# EAGLE design LS013B7DH03_TFT_Module (EAGLE 6.4)
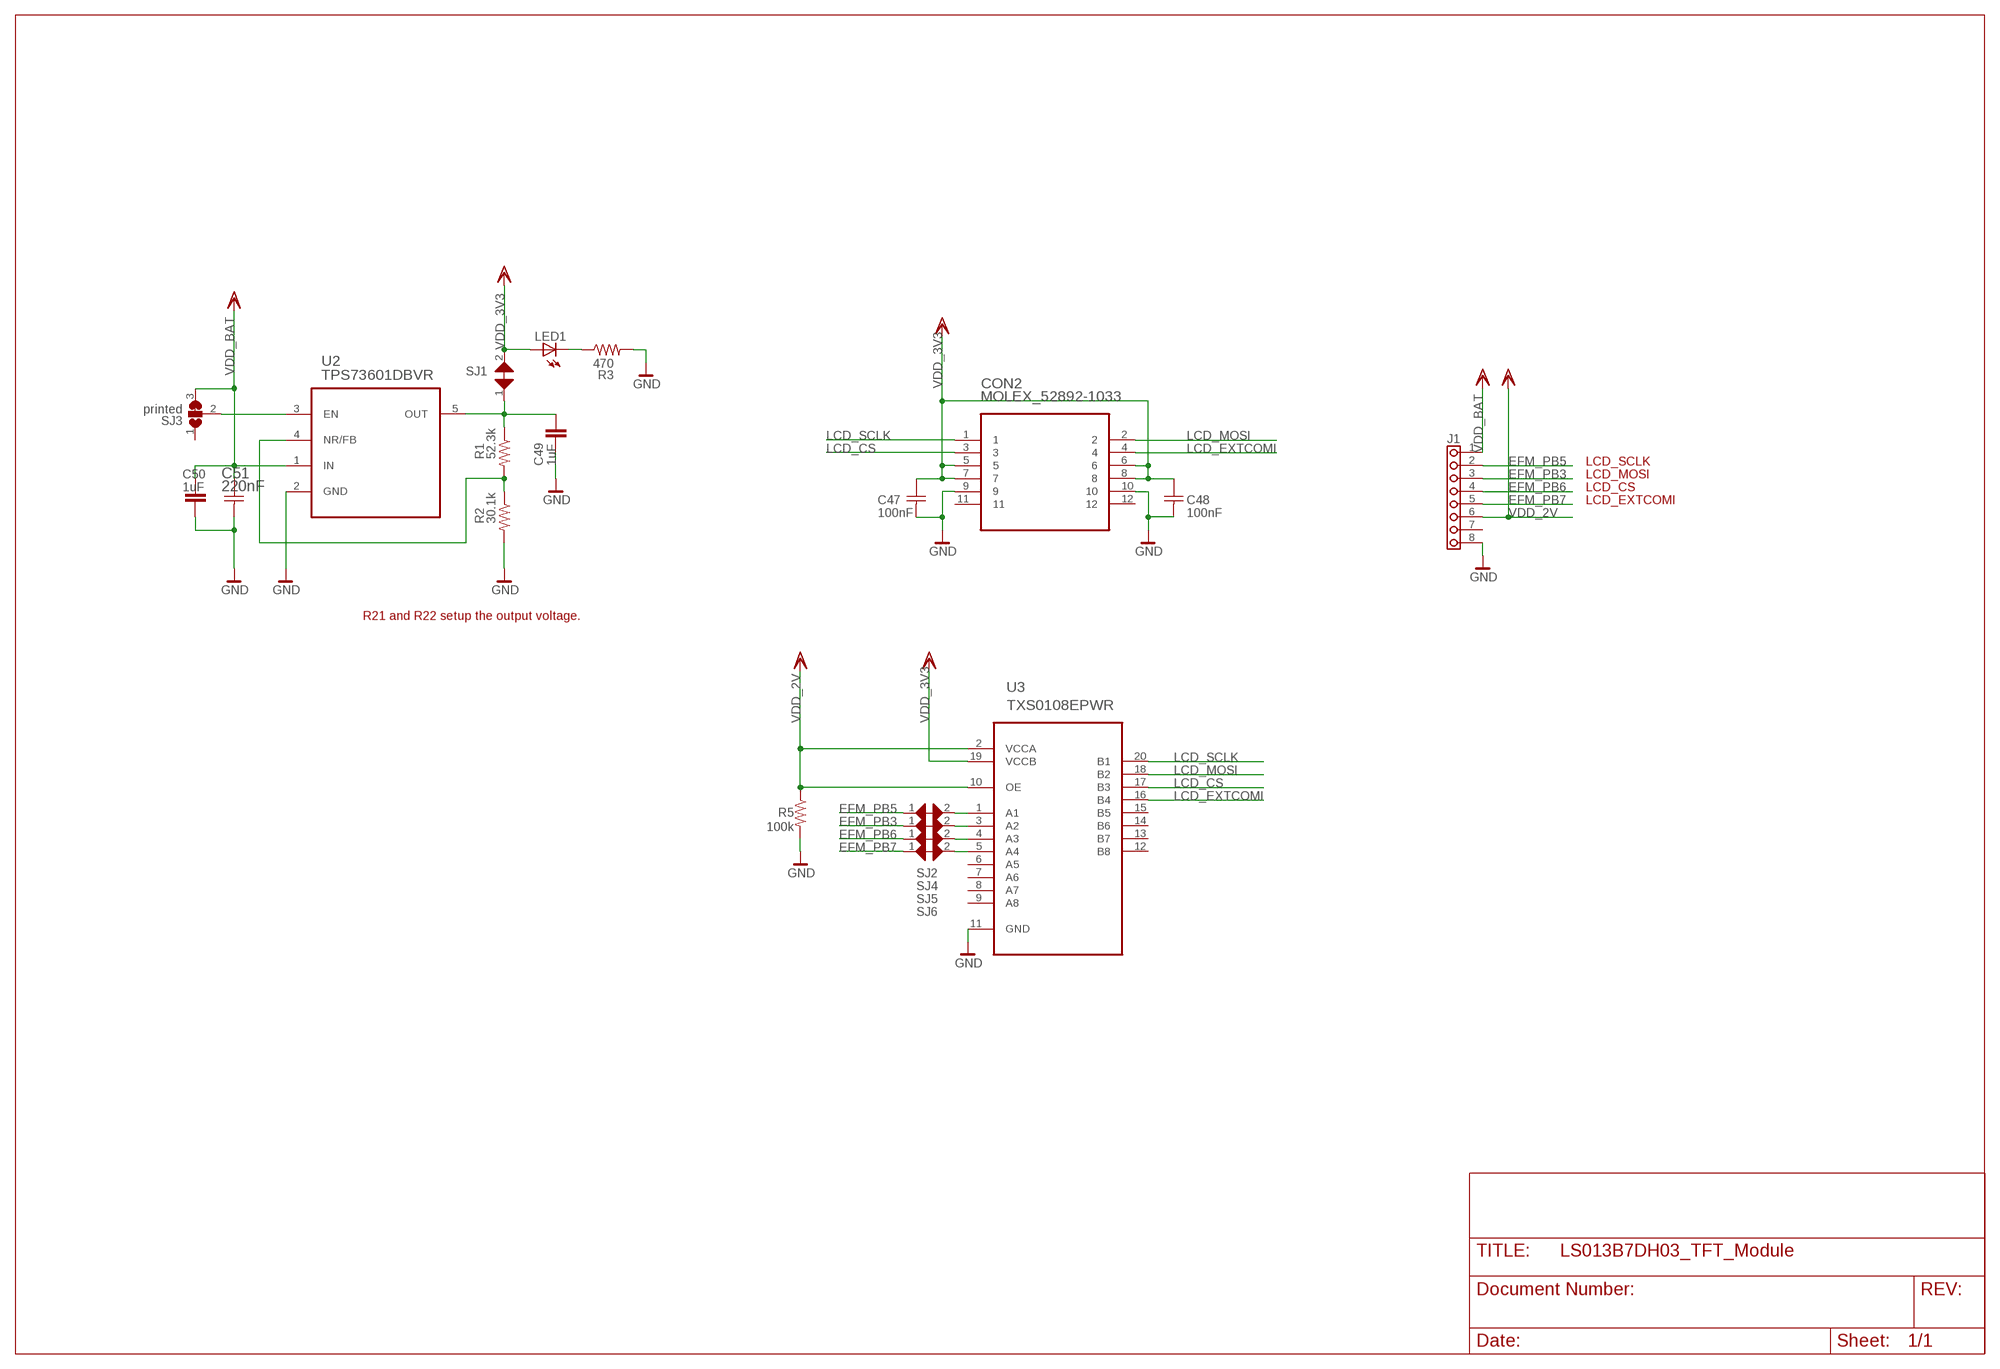
[diagram p0: schematic, sheet 1]

## Parts
C47  100nF  CAP_GRM15  [CAPC1005X60N]
C48  100nF  CAP_GRM15  [CAPC1005X60N]
C49  1uF  CAP-SMD0603  [0603]
C50  1uF  CAP-SMD0603  [0603]
C51  220nF  CAP_GRM15  [CAPC1005X60N]
CON2  MOLEX_52892-1033  MOLEX_52892-1033_FPC  [MOLEX_52892-1095]
J1  PIN8S  [PIN8S]
LED1  LED0603  [LED-0603]
R1  52.3k  R-US_R0402  [R0402]
R2  30.1k  R-US_R0402  [R0402]
R3  470  R-US_R0402  [R0402]
R5  100k  R-US_R0402  [R0402]
SJ1  printed  JUMPER_SMD_MICRO_SHORT  [JUMPER_SMD_MICRO_SHORT]
SJ2  printed  JUMPER_SMD_MICRO_SHORT  [JUMPER_SMD_MICRO_SHORT]
SJ3  printed  JUMPER_SMD_3A  [JUMPER_SMD_SJ2A]
SJ4  printed  JUMPER_SMD_MICRO_SHORT  [JUMPER_SMD_MICRO_SHORT]
SJ5  printed  JUMPER_SMD_MICRO_SHORT  [JUMPER_SMD_MICRO_SHORT]
SJ6  printed  JUMPER_SMD_MICRO_SHORT  [JUMPER_SMD_MICRO_SHORT]
U2  TPS73601DBVR  [SOT95P280X145-5N]
U3  TXS0108EPWR  TXB0108PWR  [SOP65P640X120-20N]

## Nets
EFM_PB3: J1.3 SJ4.1
EFM_PB5: J1.2 SJ2.1
EFM_PB6: J1.4 SJ5.1
EFM_PB7: J1.5 SJ6.1
GND: C47.2(C2) C48.2(C2) C49.1 C50.1 C51.2(C2) CON2.9 CON2.10 J1.8 R2.2 R3.2 R5.2 U2.2(GND) U3.11(GND)
LCD_CS: CON2.3 U3.17(B3)
LCD_EXTCOMI: CON2.4 U3.16(B4)
LCD_MOSI: CON2.2 U3.18(B2)
LCD_SCLK: CON2.1 U3.20(B1)
N$1: LED1.C R3.1
N$2: SJ2.2 U3.1(A1)
N$3: SJ4.2 U3.3(A2)
N$4: SJ5.2 U3.4(A3)
N$5: SJ6.2 U3.5(A4)
N$6: C49.2 R1.1 SJ1.1 U2.5(OUT)
N$12: R1.2 R2.1 U2.4(NR/FB)
N$16: SJ3.2 U2.3(EN)
VDD_2V: J1.6 R5.1 U3.2(VCCA) U3.10(OE)
VDD_3V3: C47.1(C1) C48.1(C1) CON2.5 CON2.6 CON2.7 CON2.8 LED1.A SJ1.2 U3.19(VCCB)
VDD_BAT: C50.2 C51.1(C1) J1.1 SJ3.3 U2.1(IN)
Unconnected: CON2.11 CON2.12 J1.7 SJ3.1 U3.6(A5) U3.7(A6) U3.8(A7) U3.9(A8) U3.12(B8) U3.13(B7) U3.14(B6) U3.15(B5)

## Notes on the sheet
- LCD_SCLK
- LCD_MOSI
- LCD_CS
- LCD_EXTCOMI
- R21 and R22 setup the output voltage.

## Library data of the parts
C47 C48 C51 = dzo:CAP_GRM15: Murata GRM15 series 0402 size capacitor; MURATA: GRM15 series
C49 C50 = lve_modositott:CAP-SMD
CON2 = dzo:MOLEX_52892-1033_FPC: MOLEX - 52892-1033 - SOCKET, FFC/FPC, ZIF, 0.50MM, 10P; DISTRI: Farnell; DISTRINR: 2361354; PARTNR: 52892-1033
J1 = lve_modositott:PIN8S
LED1 = dzo:LED: LEDs Standard schematic elements and footprints for 5mm, 3mm, 1206, and 0603 sized LEDs. 5mm - Spark Fun Electronics SKU : COM-00529 (and others)
R1-R3 R5 = resistor:R-US_: RESISTOR, American symbol
SJ1 SJ2 SJ4-SJ6 = dzo:JUMPER_SMD_MICRO_SHORT
SJ3 = lve_modositott:JUMPER_SMD_3A
U2 = dzo:TPS73601DBVR: Cap-Free, NMOS, 400mA Low-Dropout Regulator with Reverse Current Protection; ALTDISTRI_NEWARK: 87H2971; DISTRI: Farnell; DISTRINR: 1576489; PACKAGE: SOT-23-5; PARTNR: TPS73601DBVR; VENDOR: Texas Instruments
U3 = dzo:TXB0108PWR: 8-BIT BIDIRECTIONAL VOLTAGE-LEVEL TRANSLATOR; PACKAGE: TSSOP-20; SUPPLIER: Texas Instruments

## Board
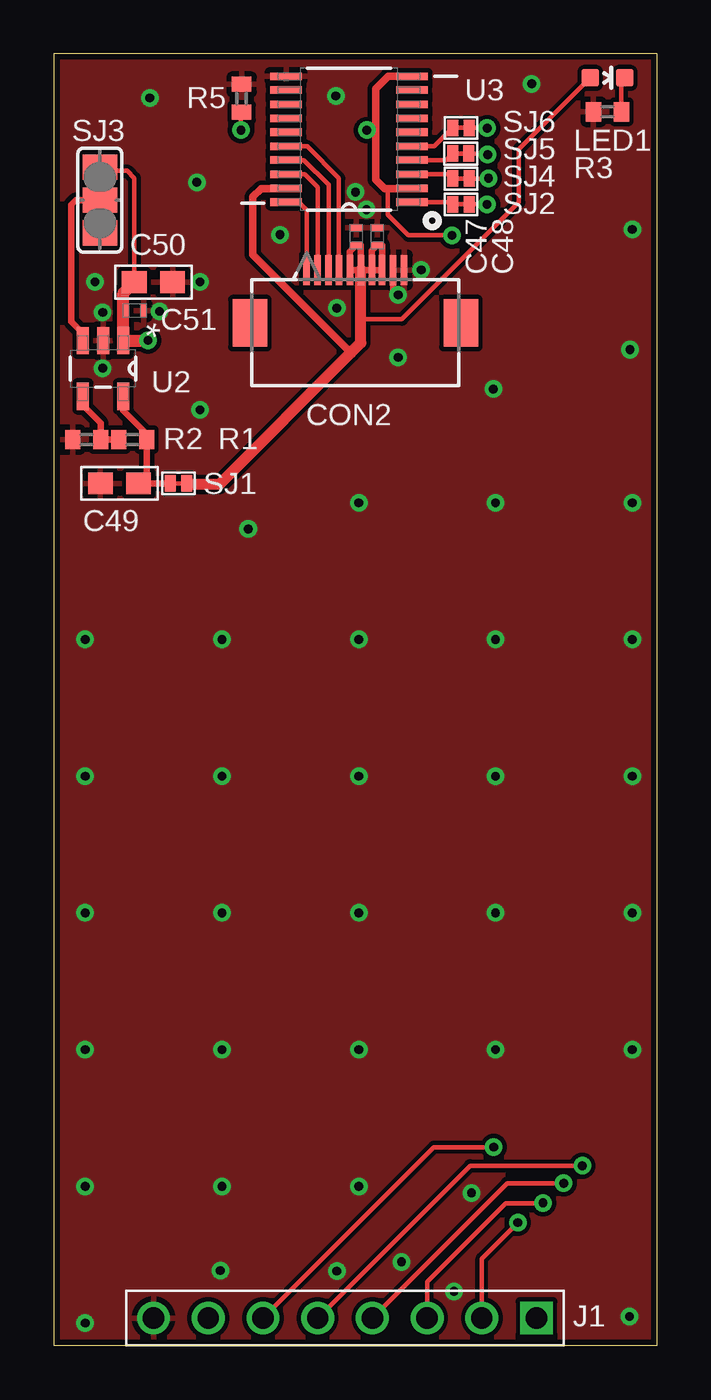
[diagram p1: board, top side]
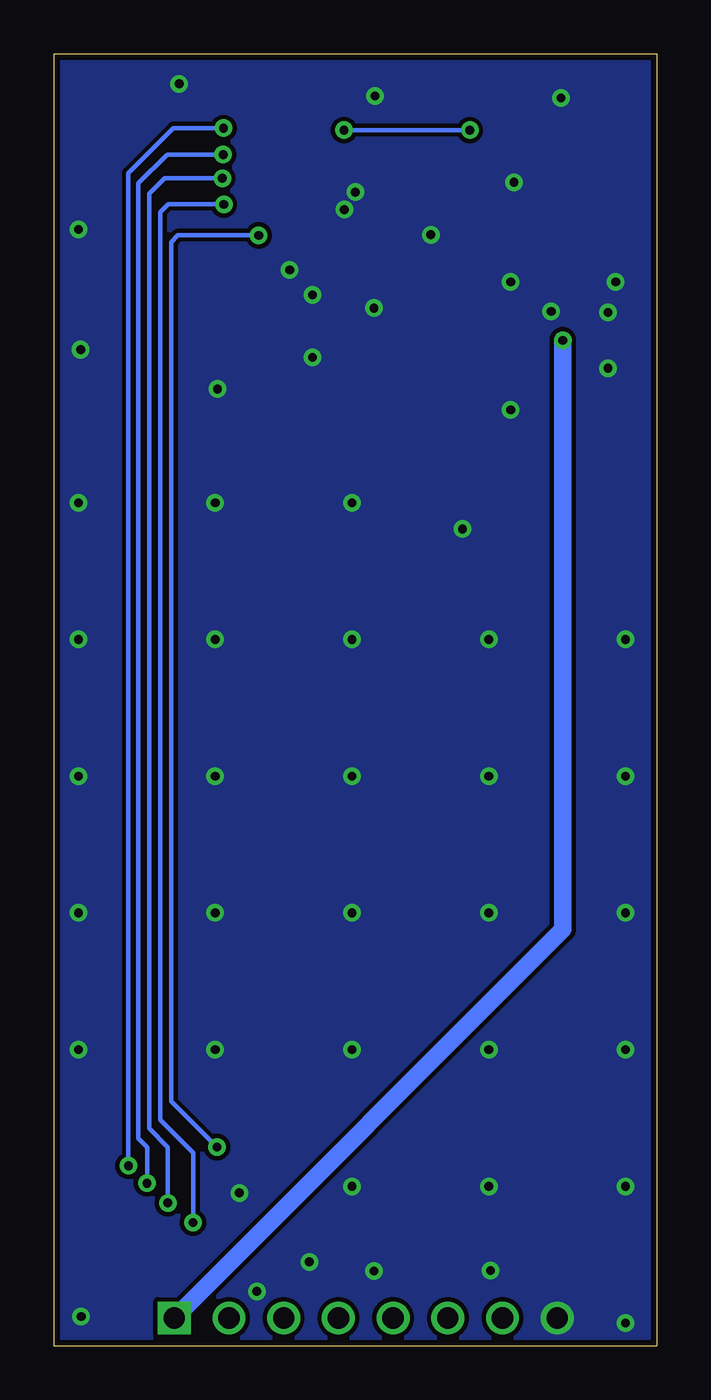
[diagram p2: board, bottom side, seen from below]

Size 28 x 60 mm. Coordinates in mm from the lower left corner, seen from the top.
Outline: 0,60 0,0 28,0 28,60 0,60
Copper layers (1*16): Top 0.0356mm / dielectric 1.5mm / Bottom 0.0356mm
Design rules "default_INTEGRATION *": minimum track width 6mil, minimum drill 16mil, track to track 8mil, track to pad 6mil, pad to pad 6mil, via to via 8mil, smd to smd 0mil, copper to edge 10mil, drill to drill 8mil, minimum pad ring 7mil, minimum via ring 8mil, stop-mask expansion 4mil, vias tented up to drill 24mil, thermal gap 10mil

### Footprints (pad centres in the part's own frame; a part is rotated, then mirrored left to right if it is on the bottom)
CAPC1005X60N = smd 0.305 x 0.61: 1 -0.406,0; 2 0.406,0
0603 = smd 1.143 x 1.016: 1 -0.889,0; 2 0.889,0
MOLEX_52892-1095 = smd 0.305 x 1.397: 1 2.261,2.896; 2 1.753,2.896; 3 1.245,2.896; 4 0.762,2.896; 5 0.254,2.896; 6 -0.254,2.896; 7 -0.762,2.896; 8 -1.245,2.896; 9 -1.753,2.896; 10 -2.261,2.896 | smd 1.6 x 2.21: 11 -4.902,5.359; 12 4.902,5.359
PIN8S = drill 0.991 pad 1.524 square: 1 0,0 | drill 0.991 pad 1.524: 2 2.54,0; 3 5.08,0; 4 7.62,0; 5 10.16,0; 6 12.7,0; 7 15.24,0; 8 17.78,0
LED-0603 = smd 0.8 x 0.8: A 0,-0.8; C 0,0.8
R0402 = smd 0.7 x 0.9: 1 -0.65,0; 2 0.65,0
JUMPER_SMD_MICRO_SHORT = smd 0.508 x 0.762: 1 -0.381,0; 2 0.381,0
JUMPER_SMD_SJ2A = smd 1.168 x 1.6: 1 -1.524,0; 2 0,0; 3 1.524,0
SOT95P280X145-5N = smd 1.27 x 0.559: 1 -1.295,0.94; 2 -1.295,0; 3 -1.295,-0.94; 4 1.295,-0.94; 5 1.295,0.94
SOP65P640X120-20N = smd 1.473 x 0.356: 1 -2.921,2.921; 2 -2.921,2.286; 3 -2.921,1.626; 4 -2.921,0.965; 5 -2.921,0.33; 6 -2.921,-0.33; 7 -2.921,-0.965; 8 -2.921,-1.626; 9 -2.921,-2.286; 10 -2.921,-2.921; 11 2.921,-2.921; 12 2.921,-2.286; 13 2.921,-1.626; 14 2.921,-0.965; 15 2.921,-0.33; 16 2.921,0.33; 17 2.921,0.965; 18 2.921,1.626; 19 2.921,2.286; 20 2.921,2.921

### Placement (x,y rotation side)
C47  14.05,51.52 90 top
C48  15.02,51.52 90 top
C49  3.05,40.05 0 top
C50  4.62,49.4 180 top
C51  3.76,48.08 0 top
CON2  14,52.85 180 top
J1  22.41,1.28 180 top
LED1  25.7,58.88 270 top
R1  3.66,42.08 180 top
R2  1.52,42.08 180 top
R3  25.7,57.31 180 top
R5  8.72,57.93 90 top
SJ1  5.79,40.05 180 top
SJ2  18.9,53.01 180 top
SJ3  2.13,53.21 90 top
SJ4  18.9,54.21 180 top
SJ5  18.89,55.37 0 top
SJ6  18.9,56.56 180 top
U2  2.29,45.38 270 top
U3  13.7,56.03 180 top

### Tracks (layer width: path | path; a pad name or v marks a point on that pad's centre or on a via)
EFM_PB3  (via drill 0.41, 0.41 pad 0.25)
  Top 0.203: v20.18,54.22 20.17,54.21 SJ4.1 | J1.3 17.33,2.96 20.98,6.61 22.69,6.61 v22.71,6.63
  Bottom 0.203: v22.71,6.63 22.71,9.22 23.57,10.08 23.57,53.5 22.85,54.22 v20.18,54.22
EFM_PB5  (via drill 0.41 pad 0.25)
  Top 0.203: v20.11,53.01 SJ2.1 | J1.2 19.87,4.04 v21.54,5.71
  Bottom 0.203: v20.11,53.01 22.69,53.01 23.06,52.64 23.06,10.49 21.54,8.97 v21.54,5.71
EFM_PB6  (via drill 0.41, 0.41 pad 0.25)
  Top 0.203: v20.14,55.32 20.09,55.37 19.27,55.37 | J1.4 21.05,7.54 v23.67,7.54
  Bottom 0.203: v20.14,55.32 22.74,55.32 24.08,53.98 24.08,9.63 23.67,9.22 v23.67,7.54
EFM_PB7  (via drill 0.41, 0.41 pad 0.25)
  Top 0.203: v20.12,56.55 20.11,56.56 SJ6.1 | J1.5 19.32,8.36 v24.54,8.36
  Bottom 0.203: v20.12,56.55 22.45,56.55 24.54,54.46 v24.54,8.36
GND  (via drill 0.41)
  Top 0.305: CON2.9 15.75,49.03 v15.98,48.8
  other vias: 1.46,26.45 26.86,26.45 26.86,32.8 26.86,39.15 1.46,32.8 26.76,46.26 26.86,51.85 7.81,26.45 14.16,26.45 20.51,26.45 20.51,32.8 14.16,32.8 7.81,32.8 14.16,39.15 20.51,39.15 14.51,52.76 14,53.58 13.09,58.05 17.05,49.97 13.14,48.19 10.5,51.6 4.45,57.95 6.64,54.03 6.79,43.47 6.79,49.41 4.91,48.04 1.46,20.1 7.81,20.1 14.16,20.1 20.51,20.1 26.86,20.1 26.86,13.75 20.51,13.75 14.16,13.75 7.81,13.75 1.46,13.75 1.46,7.4 7.81,7.4 14.16,7.4 1.46,1.05 7.73,3.49 13.14,3.46 26.73,1.35 22.18,58.61 20.41,44.43 15.99,45.91 1.91,49.41 2.27,45.4 2.27,47.99 9.03,37.93 19.39,7.09 16.14,3.89 18.58,2.52
  pour Bottom (rank 2, no thermals): 28,0 0,0 0,59.98 28.03,59.98
  pour Top (rank 2): 28,0 0,0 0,59.98 28.03,59.98
LCD_CS
  Top 0.203: CON2.3 12.76,53.91 11.61,55.06 U3.17
LCD_EXTCOMI
  Top 0.203: CON2.4 13.24,54.22 11.76,55.7 U3.16 | U3.16
LCD_MOSI
  Top 0.203: CON2.2 12.25,53.8 11.65,54.4 U3.18
LCD_SCLK
  Top 0.203: U3.20 11.36,53.11 11.74,52.73 CON2.1
N$1
  Top 0.203: LED1.C 26.36,58.73 R3.1
N$2
  Top 0.203: U3.1 18.42,53.11 SJ2.2
N$3
  Top 0.203: U3.3 18.53,54.4 SJ4.2
N$4
  Top 0.203: U3.4 18.21,55.07 18.51,55.37
N$5
  Top 0.203: U3.5 17.66,55.7 SJ6.2
N$6
  Top 0.305: U2.5 3.23,43.43 4.31,42.35 R1.1 4.31,40.42 C49.2 5.41,40.05
N$12
  Top 0.305: U2.4 1.35,43.68 2.17,42.85 R2.1 R1.2
N$16
  Top 0.305: SJ3.2 1.02,53.21 0.81,53 0.81,47.57 1.35,47.03 U2.3
VDD_2V  (via drill 0.41, 0.41 pad 0.25)
  Top 0.203: R5.1 8.69,57.25 v8.69,56.46 | v14.53,56.46 14.95,56.46 | U3.2 15.49,53.74 | 15.34,53.74 15.49,53.74 | 15.49,53.74 15.49,52.53 16.46,51.57 v18.49,51.57 | v20.42,9.22 17.65,9.22 J1.6
  Top 0.356: U3.2 15.37,53.74 14.95,54.16 14.95,56.46 14.95,58.37 15.53,58.95 U3.10
  Bottom 0.203: v8.69,56.46 v14.53,56.46 | v18.49,51.57 22.25,51.57 22.55,51.26 22.55,11.35 v20.42,9.22
VDD_3V3
  Top 0.203: 24.84,58.88 LED1.A 21.59,55.57 21.59,53.1 16.15,47.67 14.25,47.67
  Top 0.305: CON2.6 14.25,51.11 C47.1 13.75,50.81 CON2.5 13.76,49.94 15.24,49.94 15.22,49.96 CON2.7 14.76,50.85 C48.1 15.24,51.11 CON2.8
  Top 0.356: U3.19 9.63,53.74 9.25,53.36 9.25,50.67 13.79,46.12
  Top 0.508: 6.17,40.05 6.22,40 7.67,40 13.79,46.12 14.25,46.58 14.25,47.67 CON2.6
VDD_BAT  (via drill 0.41 pad 0.25)
  Top 0.203: 3.23,48.89 3.35,48.76 C51.1 | SJ3.3 2.3,54.57 3.4,54.57 3.73,54.24 C50.2
  Top 0.559: C50.2 3.23,48.89 U2.1 4.36,46.68 v4.37,46.69
  Bottom 0.813: v4.37,46.69 4.37,19.32 J1.1

### Text on the board
Top: TOP
Bottom: BOTTOM